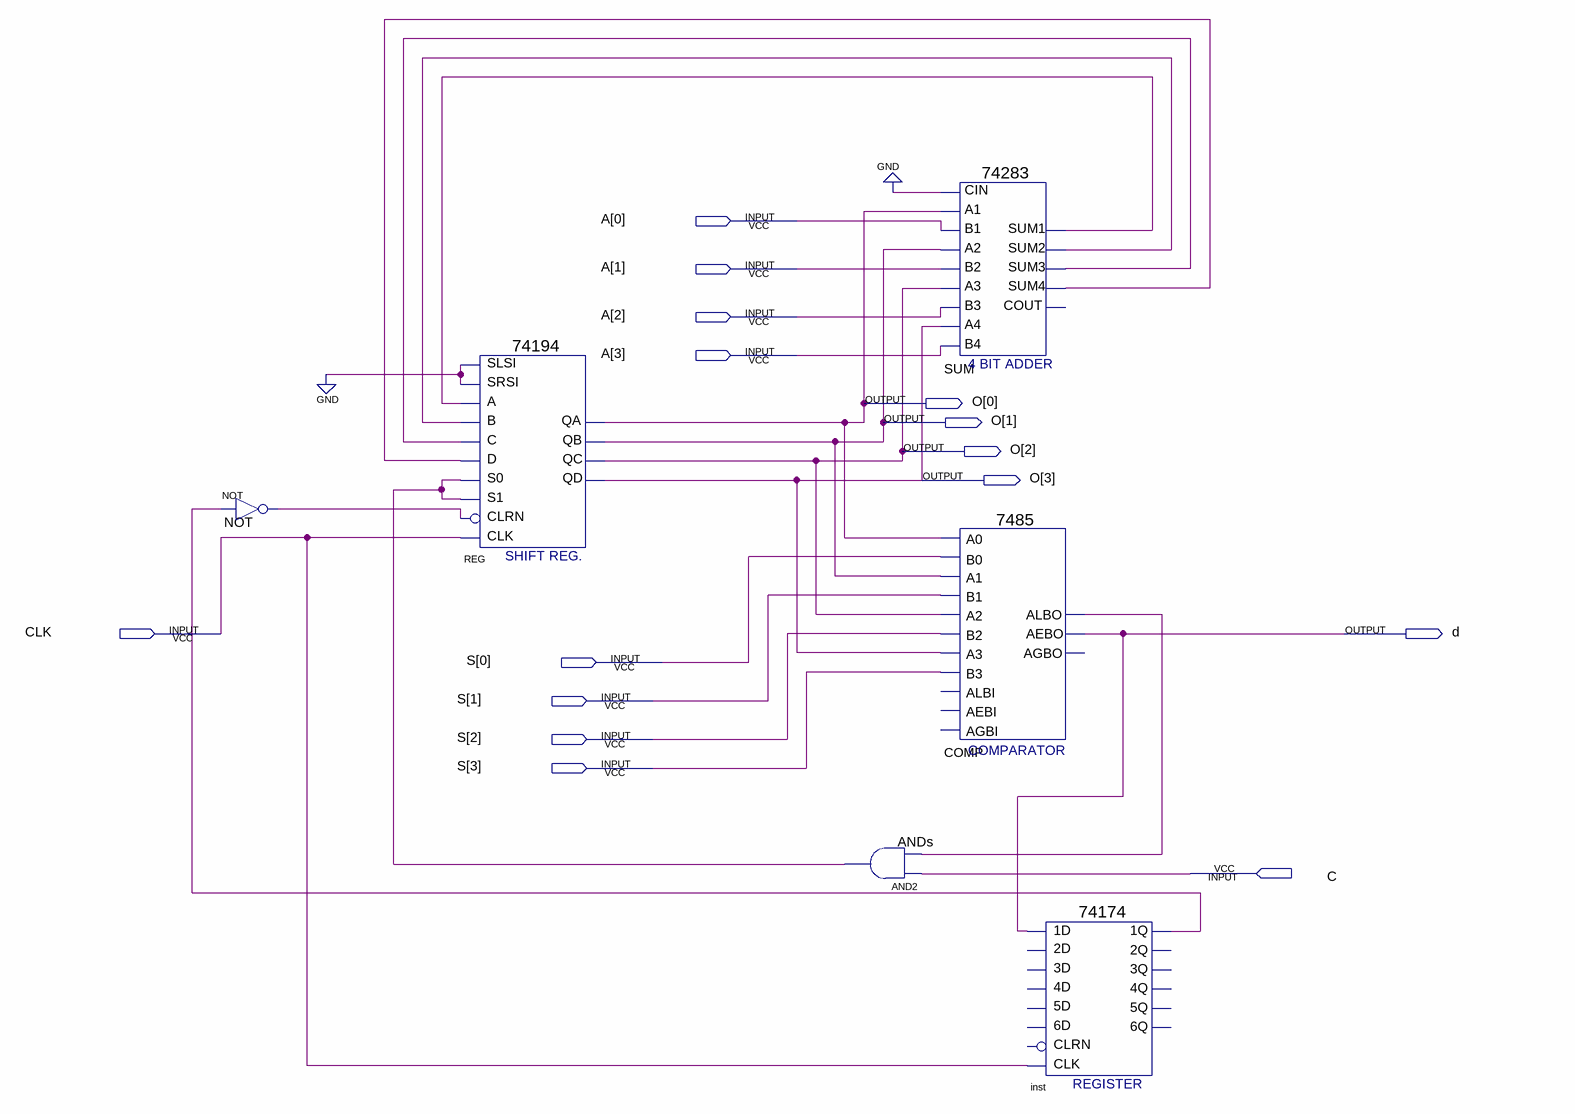
[diagram p0: schematic sheet]
// Quartus schematic MQV.bdf as structural Verilog: 6 symbols, 15 pins
module MQV (
  input  [3:0] A,
  input  CLK,
  input  [3:0] S,
  input  C,
  output [3:0] O,
  output d
);

  wire ANDs_out, COMP_albo, inst_1q, NOT_out, SUM_sum1, SUM_sum2, SUM_sum3, SUM_sum4;

  not NOT (NOT_out, inst_1q);
  \74194  REG (
    .SLSI(1'b0), .SRSI(1'b0), .B(SUM_sum2), .C(SUM_sum3), .CLK(CLK), .CLRN(NOT_out), .D(SUM_sum4),
    .S1(ANDs_out), .S0(ANDs_out), .A(SUM_sum1), .QA(O[0]), .QB(O[1]), .QC(O[2]), .QD(O[3]));
  and ANDs (ANDs_out, C, COMP_albo);
  \74283  SUM (
    .CIN(1'b0), .A1(O[0]), .A2(O[1]), .B2(A[1]), .A3(O[2]), .A4(O[3]), .B4(A[3]), .B1(A[0]), .B3(A[2]),
    .SUM4(SUM_sum4), .SUM1(SUM_sum1), .SUM2(SUM_sum2), .SUM3(SUM_sum3));  // open: COUT
  \7485  COMP (
    .A3(O[3]), .B2(S[2]), .A2(O[2]), .A0(O[0]), .B0(S[0]), .B3(S[3]), .A1(O[1]), .B1(S[1]), .ALBO(COMP_albo),
    .AEBO(d));  // open: AEBI, AGBI, ALBI, AGBO
  \74174  inst (.CLK(CLK), .\1D (d), .\1Q (inst_1q));  // open: 4D, 3D, 5D, 6D, CLRN, 2D, 4Q, 3Q, 2Q, 6Q, 5Q
endmodule
